# Altium schematic sheet ADC.SchDoc
size A4; Organization: Altium Limited; Address1: L3, 12a Rodborough Rd; Address2: Frenchs Forest; Address3: NSW; Address4: Australia 2086
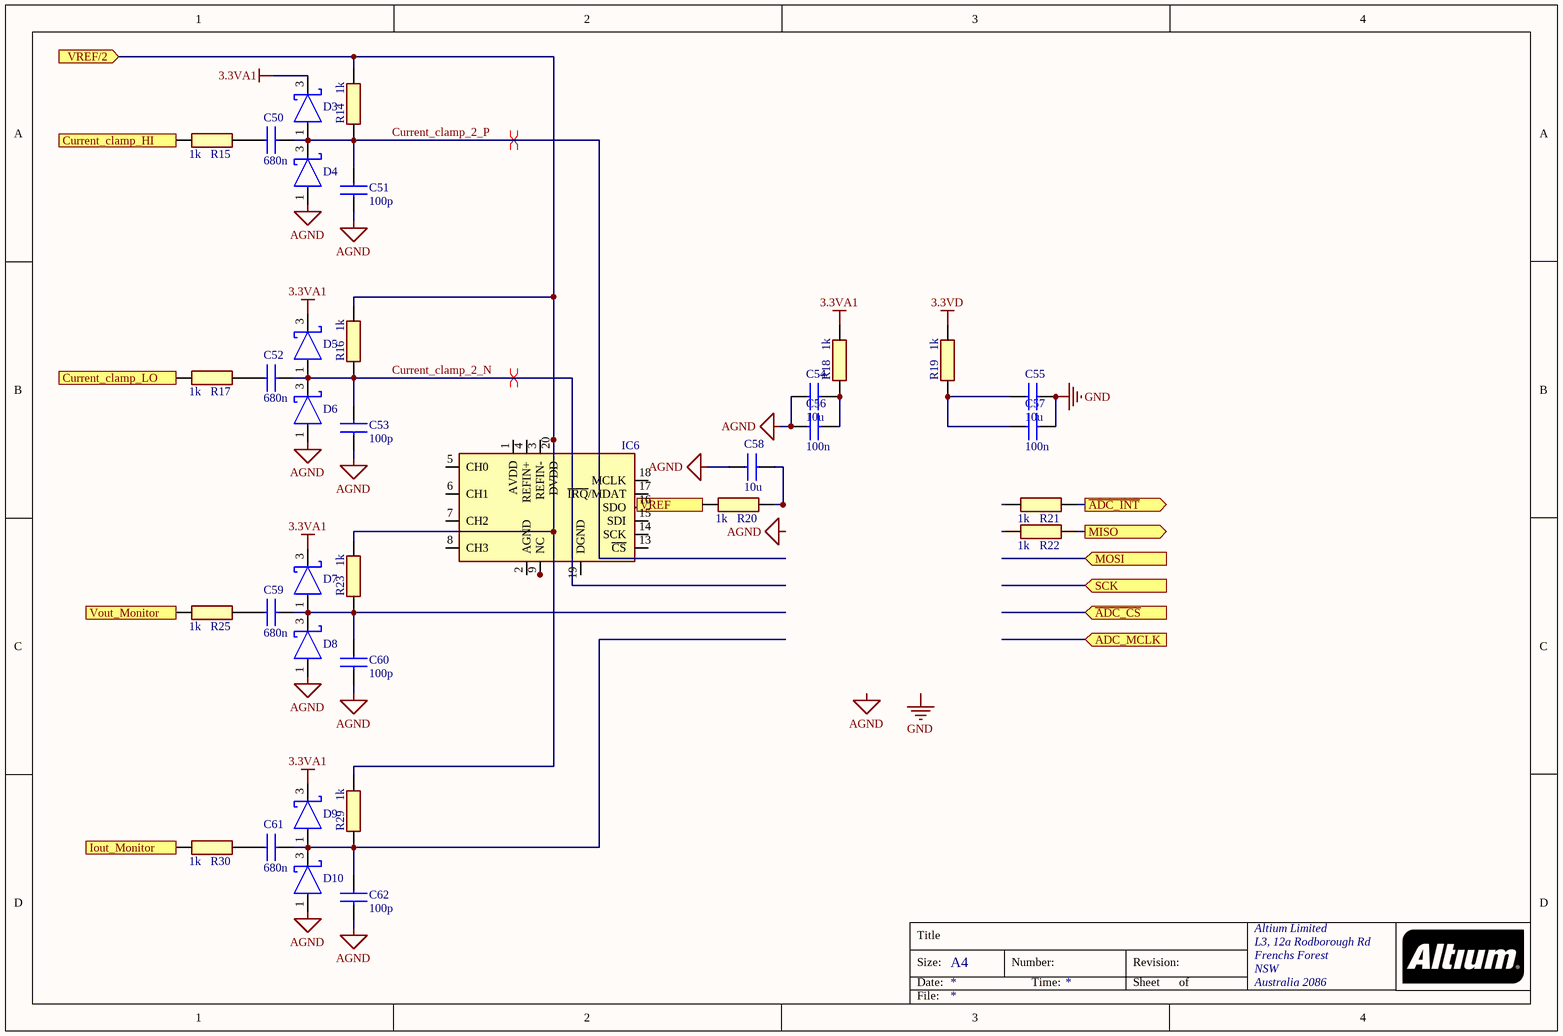
[diagram p0: ADC.SchDoc]

## Parts
C50  value 680n  [R82DC3680AA60J]  (hidden comment: R82DC3680AA60J)
C51  value 100p  [CAPC2012X140N]  (hidden comment: Capacitor_SMD)
C52  value 680n  [R82DC3680AA60J]  (hidden comment: R82DC3680AA60J)
C53  value 100p  [CAPC2012X140N]  (hidden comment: Capacitor_SMD)
C54  value 10u  [CAPC2012X140N]  (hidden comment: Capacitor_SMD)
C55  value 10u  [CAPC2012X140N]  (hidden comment: Capacitor_SMD)
C56  value 100n  [CAPC2012X140N]  (hidden comment: Capacitor_SMD)
C57  value 100n  [CAPC2012X140N]  (hidden comment: Capacitor_SMD)
C58  value 10u  [CAPC2012X140N]  (hidden comment: Capacitor_SMD)
C59  value 680n  [R82DC3680AA60J]  (hidden comment: R82DC3680AA60J)
C60  value 100p  [CAPC2012X140N]  (hidden comment: Capacitor_SMD)
C61  value 680n  [R82DC3680AA60J]  (hidden comment: R82DC3680AA60J)
C62  value 100p  [CAPC2012X140N]  (hidden comment: Capacitor_SMD)
D3  BAS40  [SOT65P210X110-3N]  (value not drawn)
D4  BAS40  [SOT65P210X110-3N]  (value not drawn)
D5  BAS40  [SOT65P210X110-3N]  (value not drawn)
D6  BAS40  [SOT65P210X110-3N]  (value not drawn)
D7  BAS40  [SOT65P210X110-3N]  (value not drawn)
D8  BAS40  [SOT65P210X110-3N]  (value not drawn)
D9  BAS40  [SOT65P210X110-3N]  (value not drawn)
D10  BAS40  [SOT65P210X110-3N]  (value not drawn)
IC6  MCP3462T-E_NC  [SOP65P640X120-20N]  (value not drawn)
R14  value 1k  [RESC2012X60N]  (hidden comment: Res_SMD)
R15  value 1k  [RESC2012X60N]  (hidden comment: Res_SMD)
R16  value 1k  [RESC2012X60N]  (hidden comment: Res_SMD)
R17  value 1k  [RESC2012X60N]  (hidden comment: Res_SMD)
R18  value 1k  [RESC2012X60N]  (hidden comment: Res_SMD)
R19  value 1k  [RESC2012X60N]  (hidden comment: Res_SMD)
R20  value 1k  [RESC2012X60N]  (hidden comment: Res_SMD)
R21  value 1k  [RESC2012X60N]  (hidden comment: Res_SMD)
R22  value 1k  [RESC2012X60N]  (hidden comment: Res_SMD)
R23  value 1k  [RESC2012X60N]  (hidden comment: Res_SMD)
R25  value 1k  [RESC2012X60N]  (hidden comment: Res_SMD)
R29  value 1k  [RESC2012X60N]  (hidden comment: Res_SMD)
R30  value 1k  [RESC2012X60N]  (hidden comment: Res_SMD)

## Ports
ADC_MCLK (in), Current_clamp_HI (in), Current_clamp_LO (in), Iout_Monitor (in), MISO (out), MOSI (in), SCK (in), Vout_Monitor (in), VREF (in), VREF/2 (in), ~{ADC_CS} (in), ~{ADC_INT} (out)

## Nets
3.3VA1: D3.3(K) D5.3(K) D7.3(K) D9.3(K) R18.2
3.3VD: R19.2
AGND: C51.2 C53.2 C54.2 C56.2 C58.2 C60.2 C62.2 D4.1(A) D6.1(A) D8.1(A) D10.1(A)
GND: C55.1 C57.1
~{ADC_INT}: R21.1 ; port ~{ADC_INT}
Current_clamp_2_N: C52.2 C53.1 D5.1(A) D6.3(K) R16.1
Current_clamp_2_P: C50.2 C51.1 D3.1(A) D4.3(K) R14.1
Current_clamp_HI: R15.2 ; port Current_clamp_HI
Current_clamp_LO: R17.2 ; port Current_clamp_LO
Iout_Monitor: R30.2 ; port Iout_Monitor
MISO: R22.1 ; port MISO
Vout_Monitor: R25.2 ; port Vout_Monitor
VREF: R20.2 ; port VREF
VREF/2: IC6.20(DVDD) R14.2 R16.2 R23.2 R29.2 ; port VREF/2
NetC50_1: C50.1 R15.1
NetC52_1: C52.1 R17.1
NetC54_1: C54.1 C56.1 R18.1
NetC55_2: C55.2 C57.2 R19.1
NetC58_1: C58.1 R20.1
NetC59_1: C59.1 R25.1
NetC59_2: C59.2 C60.1 D7.1(A) D8.3(K) R23.1
NetC61_1: C61.1 R30.1
NetC61_2: C61.2 C62.1 D9.1(A) D10.3(K) R29.1
NetIC6_9: IC6.9(NC) IC6.10(NC) IC6.11(NC) IC6.12(NC)

Not connected (* = marked no-connect by the designer): IC6 1(AVDD) 2(AGND) 3(REFIN-) 4(REFIN+) 5(CH0) 6(CH1) 7(CH2) 8(CH3) 13(~{CS}) 14(SCK) 15(SDI) 16(SDO) 17(~{IRQ}/MDAT) 18(MCLK) 19(DGND); R21 2; R22 2

## Layout directives
differential pair: Current_clamp_2_N, Current_clamp_2_P

## Notes on the sheet
- Labels drawn without touching a wire or pin: AGND, GND
- Title
- Size:
- Date:
- A4
- Number:
- Time:
- Revision:
- Sheet
- of
- File:

## Library data of the parts
C50 C52 C59 C61 = R82DC3680AA60J: Capacitor; Manufacturer_Name: Kemet; Datasheet Link: https://www.kemet.com/specsheet/R82DC3680AA60J; Height: 9.6mm; Manufacturer_Part_Number: R82DC3680AA60J; Mouser Part Number: 80-R82DC3680AA60J; Mouser Price/Stock: https://www.mouser.com/Search/Refine.aspx?Keyword=80-R82DC3680AA60J; Arrow Part Number: R82DC3680AA60J; Arrow Price/Stock: https://www.arrow.com/en/products/r82dc3680aa60j/kemet-corporation
C51 C53-C58 C60 C62 = Capacitor_SMD: Capacitor smd ceramic; Manufacturer_Name: TDK; Manufacturer_Part_Number: C3216C0G1H562J060AA; Datasheet Link: https://product.tdk.com/info/en/catalog/datasheets/mlcc_commercial_midvoltage_en.pdf; Height: 0.75mm
D3-D10 = BAS40: Diode; Manufacturer_Name: Nexperia; Manufacturer_Part_Number: BAS40-04W,115; Datasheet Link: https://assets.nexperia.com/documents/data-sheet/BAS40_1PSXXSB4X_SER.pdf; Height: 1.1mm; Mouser Part Number: 771-BAS40-04W-T/R; Mouser Price/Stock: https://www.mouser.co.uk/ProductDetail/Nexperia/BAS40-04W115?qs=me8TqzrmIYWDwJcnI64JHw%3D%3D; Arrow Part Number: BAS40-04W,115; Arrow Price/Stock: https://www.arrow.com/en/products/bas40-04w115/nexperia?region=nac
IC6 = MCP3462T-E_NC: Integrated Circuit; Manufacturer_Name: Microchip; Manufacturer_Part_Number: MCP3462T-E/NC; Datasheet Link: http://ww1.microchip.com/downloads/en/DeviceDoc/MCP3461-2-4_Data-Sheet-20006180A.pdf; Height: 0.6mm; Mouser Part Number: 579-MCP3462T-E/NC; Mouser Price/Stock: https://www.mouser.co.uk/ProductDetail/Microchip-Technology/MCP3462T-E-NC?qs=byeeYqUIh0NcNWUdwm8hpg%3D%3D
R14-R23 R25 R29 R30 = Res_SMD: Resistor SMD; Manufacturer_Name: Bourns; Manufacturer_Part_Number: CR1206-FW-1504ELF; Datasheet Link: http://componentsearchengine.com/Datasheets/1/CR1206-FW-1504ELF.pdf; Height: 0.75mm; Mouser Part Number: 652-CR1206FW1504ELF; Mouser Price/Stock: https://www.mouser.co.uk/ProductDetail/Bourns/CR1206-FW-1504ELF/?qs=6oMev5NRZMFfvXkOpYL2%252BA%3D%3D; Arrow Part Number: CR1206-FW-1504ELF; Arrow Price/Stock: https://www.arrow.com/en/products/cr1206-fw-1504elf/bourns